# Altium schematic sheet PCIe-M2.SchDoc
size 420 x 297 mm; Organization: Q-Wave Systems Co.,Ltd; Address1: No.1; Address2: Suksawat 33/1; Address3: Ratburana; Address4: Bangkok Thailand
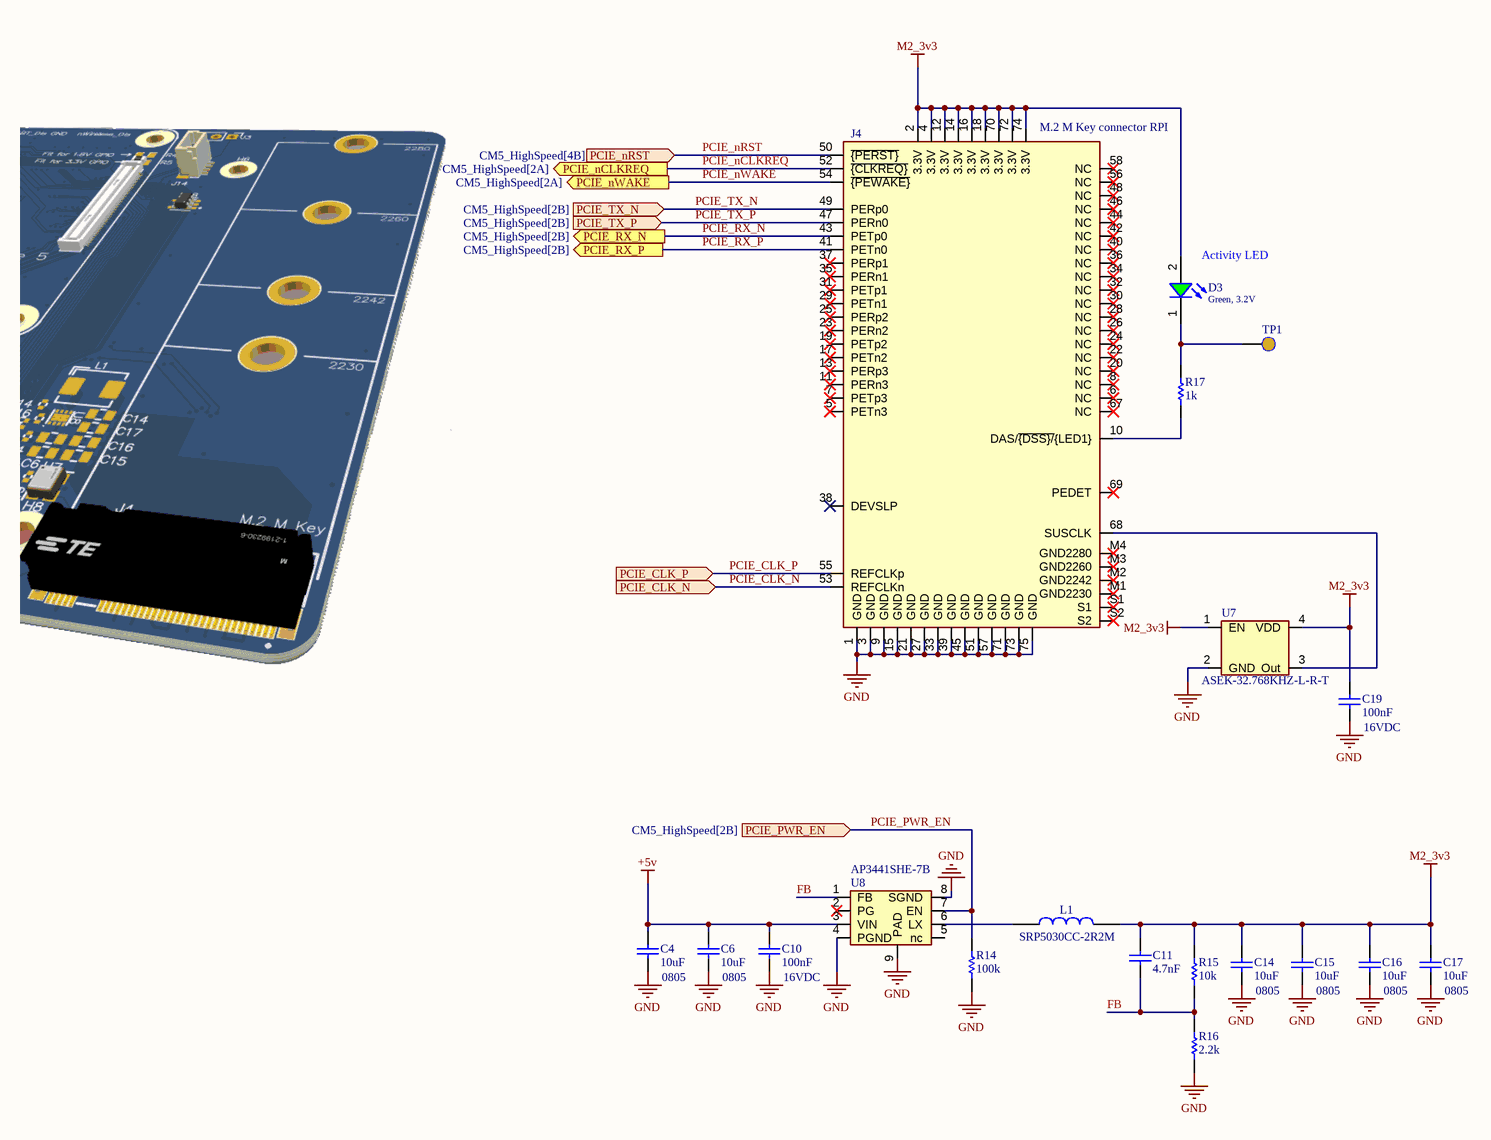
[diagram p0: PCIe-M2.SchDoc]

## Parts
C4  value 10uF  Size: 0805  [WCAP-CSGP_0805_H=1.25mm]  (hidden comment: 10uF, 16V)
C6  value 10uF  Size: 0805  [WCAP-CSGP_0805_H=1.25mm]  (hidden comment: 10uF, 16V)
C10  value 100nF  Rated Voltage: 16VDC  [WCAP-CSGP_0402_H=0.5mm]  (hidden comment: 100nF, 16V)
C11  value 4.7nF  [WCAP-CSGP_0402_H=0.5mm]  (hidden comment: 4.7nF, 16V)
C14  value 10uF  Size: 0805  [WCAP-CSGP_0805_H=1.25mm]  (hidden comment: 10uF, 16V)
C15  value 10uF  Size: 0805  [WCAP-CSGP_0805_H=1.25mm]  (hidden comment: 10uF, 16V)
C16  value 10uF  Size: 0805  [WCAP-CSGP_0805_H=1.25mm]  (hidden comment: 10uF, 16V)
C17  value 10uF  Size: 0805  [WCAP-CSGP_0805_H=1.25mm]  (hidden comment: 10uF, 16V)
C19  value 100nF  Rated Voltage: 16VDC  [WCAP-CSGP_0402_H=0.5mm]  (hidden comment: 100nF, 16V)
D3  Green, 3.2V  [WL-SMCW_0603_H=0.7mm_Green]
J4  M.2 M Key connector RPI  [M.2 M Key connector RPI]
L1  SRP5030CC-2R2M  [SRP5030CC-2R2M]
R14  value 100k  [SMD-0402-RES]  (hidden comment: RES SMD 100K OHM 1% 1/10W 0402)
R15  value 10k  [SMD-0402-RES]  (hidden comment: RES SMD 10K OHM 1% 1/10W 0402)
R16  value 2.2k  [SMD-0402-RES]  (hidden comment: RES SMD 2.2K OHM 1% 1/10W 0402)
R17  value 1k  [SMD-0402-RES]  (hidden comment: RES SMD 1K OHM 1% 1/10W 0402)
TP1  TEST_POINT 1  [TEST_POINT 1]  (value not drawn)  (no BOM)
U7  ASEK-32.768KHZ-L-R-T  [ASEK-32.768KHZ-L-R-T]
U8  AP3441SHE-7B  [AP3441SHE-7B]

## Ports
PCIE_CLK_N (in, see CM5_HighSpeed[2B]), PCIE_CLK_P (in, see CM5_HighSpeed[2B]), PCIE_nCLKREQ (out, see CM5_HighSpeed[2A]), PCIE_nRST (in, see CM5_HighSpeed[4B]), PCIE_nWAKE (out, see CM5_HighSpeed[2A]), PCIE_PWR_EN (in, see CM5_HighSpeed[2B]), PCIE_RX_N (out, see CM5_HighSpeed[2B]), PCIE_RX_P (out, see CM5_HighSpeed[2B]), PCIE_TX_N (in, see CM5_HighSpeed[2B]), PCIE_TX_P (in, see CM5_HighSpeed[2B])

## Nets
+5v: C4.2 C6.2 C10.2 U8.3(VIN)
GND: C4.1 C6.1 C10.1 C14.1 C15.1 C16.1 C17.1 C19.1 J4.1(GND) J4.3(GND) J4.9(GND) J4.15(GND) J4.21(GND) J4.27(GND) J4.33(GND) J4.39(GND) J4.45(GND) J4.51(GND) J4.57(GND) J4.71(GND) J4.73(GND) J4.75(GND) R14.1 R16.1 U7.2(GND) U8.4(PGND) U8.8(SGND) U8.9(PAD)
M2_3v3: C11.2 C14.2 C15.2 C16.2 C17.2 C19.2 D3.2(A) J4.2(3.3V) J4.4(3.3V) J4.12(3.3V) J4.14(3.3V) J4.16(3.3V) J4.18(3.3V) J4.70(3.3V) J4.72(3.3V) J4.74(3.3V) L1.2 R15.2 U7.1(EN) U7.4(VDD)
FB: C11.1 R15.1 R16.2 U8.1(FB)
PCIE_CLK_N: J4.53(REFCLKn) ; port PCIE_CLK_N
PCIE_CLK_P: J4.55(REFCLKp) ; port PCIE_CLK_P
PCIE_nCLKREQ: J4.52(~{{CLKREQ}}) ; port PCIE_nCLKREQ
PCIE_nRST: J4.50(~{{PERST}}) ; port PCIE_nRST
PCIE_nWAKE: J4.54(~{{PEWAKE}}) ; port PCIE_nWAKE
PCIE_PWR_EN: R14.2 U8.7(EN) ; port PCIE_PWR_EN
PCIE_RX_N: J4.43(PETp0) ; port PCIE_RX_N
PCIE_RX_P: J4.41(PETn0) ; port PCIE_RX_P
PCIE_TX_N: J4.49(PERp0) ; port PCIE_TX_N
PCIE_TX_P: J4.47(PERn0) ; port PCIE_TX_P
NetD3_1: D3.1(K) R17.2 TP1.1
NetJ4_10: J4.10(DAS/~{{DSS}/}{LED1}) R17.1
NetJ4_68: J4.68(SUSCLK) U7.3(Out)
NetL1_1: L1.1 U8.6(LX)

Not connected (* = marked no-connect by the designer): J4 5(PETn3)* 6(NC)* 7(PETp3)* 8(NC)* 11(PERn3)* 13(PERp3)* 17(PETn2)* 19(PETp2)* 20(NC)* 22(NC)* 23(PERn2)* 24(NC)* 25(PERp2)* 26(NC)* 28(NC)* 29(PETn1)* 30(NC)* 31(PETp1)* 32(NC)* 34(NC)* 35(PERn1)* 36(NC)* 37(PERp1)* 38(DEVSLP)* 40(NC)* 42(NC)* 44(NC)* 46(NC)* 48(NC)* 56(NC)* 58(NC)* 67(NC)* 69(PEDET)* M1(GND2230)* M2(GND2242)* M3(GND2260)* M4(GND2280)* S1* S2*; U8 2(PG)* 5(nc)

## Notes on the sheet
- (near D3) Activity LED
- Status:
- Revision:
- Variant:
- Vesion:
- Title
- Size:
- Date:
- A3
- DrawnBy:
- Number:
- CheckBy:
- Sheet
- of
- File:

## Library data of the parts
C4 C6 C14-C17 = CMP-01449-2: WCAP-CSGP Multilayer Ceramic Chip Capacitor, General Purpose, size 0805, X5R, 10uF, 16V; Manufacturer: Wurth Elektronik; Manufacturer Part Number: 885012107014; Isolation Resistance  min.: 0.01GOhm; Dissipation Factor max.: 10%; Capacitance Tolerance: +/-20%; Technical Reference: X5R0805106M016DFCT10000; Rated Voltage: 16VDC; Packaging: Tape and Reel; ComponentLink2URL: https://www.we-online.com/catalog/datasheet/885012107014.pdf; Height: 1.25mm; Source: WCAP-CSGP_0805.SchLib; Design Item ID: 885012107014; ComponentLink2Description: Datasheet; Pin Count: 2; Capacitance: 10uF; ComponentLink1URL: http://www.we-online.de; Operating Temperature: -55 to +85degC; Published Date: April 2021; Mounting Technology: SMT; Ceramic Type: X5R; ComponentLink1Description: Manufacturer; Component Type: Standard; Q-Factor min.: -
C10 C19 = CMP-01409-2: WCAP-CSGP Multilayer Ceramic Chip Capacitor, General Purpose, size 0402, X5R, 100nF, 16V; Manufacturer Part Number: 885012105016; Manufacturer: Wurth Elektronik; Technical Reference: X5R0402104M016DFCT10000; Isolation Resistance  min.: 5GOhm; Dissipation Factor max.: 5%; Capacitance Tolerance: +/-20%; Published Date: April 2021; Height: 0.5mm; Operating Temperature: -55 to +85degC; Source: WCAP-CSGP_0402.SchLib; Packaging: Tape and Reel; Q-Factor min.: -; Component Type: Standard; Capacitance: 100nF; Ceramic Type: X5R; ComponentLink1Description: Manufacturer; ComponentLink1URL: http://www.we-online.de; ComponentLink2URL: https://www.we-online.com/catalog/datasheet/885012105016.pdf; Pin Count: 2; Size: 0402; Mounting Technology: SMT; Design Item ID: 885012105016; ComponentLink2Description: Datasheet
C11 = CMP-01518-2: WCAP-CSGP Multilayer Ceramic Chip Capacitor, General Purpose, size 0402, X7R, 4.7nF, 16V; Manufacturer: Wurth Elektronik; Manufacturer Part Number: 885012205029; Dissipation Factor max.: 3.5%; Isolation Resistance  min.: 10GOhm; Capacitance Tolerance: +/-10%; Technical Reference: X7R0402472K016DFCT10000; Rated Voltage: 16VDC; Capacitance: 4.7nF; ComponentLink1URL: http://www.we-online.de; ComponentLink2URL: https://www.we-online.com/catalog/datasheet/885012205029.pdf; Height: 0.5mm; Q-Factor min.: -; ComponentLink1Description: Manufacturer; Pin Count: 2; Component Type: Standard; Ceramic Type: X7R; Source: WCAP-CSGP_0402.SchLib; Operating Temperature: -55 to +125degC; Mounting Technology: SMT; ComponentLink2Description: Datasheet; Packaging: Tape and Reel; Size: 0402; Design Item ID: 885012205029; Published Date: April 2021
D3 = CMP-00983-5: WL-SMCW SMT Mono-color Chip LED Waterclear, size 0603, Green, 3.2V, 140deg; Part Number: 150060GS75000; SM P/N: 59100121; Peak Wavelength typ.: 515nm; ES P/N: 0176-1070-9; Luminous Intensity typ.: 430mcd; Chip Technology: InGaN; Dominant Wavelength typ.: 525nm; Pin Count: 2; Forward Voltage typ.: 3.2V; Viewing Angle: 140deg; Packaging: Tape and Reel; Emitting Color: Green; Publisher: Wurth Elektronik; ComponentLink1URL: http://www.we-online.de; Source: WL-SMCW_0603.SchLib; ComponentLink2URL: https://www.we-online.com/catalog/datasheet/150060GS75000.pdf; ComponentLink2Description: Datasheet; Operating Temperature: -40 to +85degC; Design Item ID: 150060GS75000; Size: 0603; Mounting Technology: SMT; Published Date: December 2019; Value: Green, 3.2V; ComponentLink1Description: Manufacturer; Component Type: Standard
J4 = CMP-633-000140-1: M.2 NGFF M-KEY H4.2mm Conn Card Edge SKT 67 POS 0.5mm Solder RA SMD T/R; Gender: Female; Number of Positions: 67; Contact Current Rating: 500mA; SM P/N: 13806721; PCB Mounting Orientation: Right Angle; Termination: Solder; Insulation Material: Thermoplastic; Number of Rows: 2; Housing Color: Black; Min Operating Temperature: -40°C; ELV: Compliant; Height: 0.165inch; Orientation: Right Angle; Pitch: 0.5mm; Contact Plating: Gold,Matte; Mount: Surface Mount; Length: 0.862inch; Width: 8.7mm; RoHS Compliant: Yes; Housing Material: Thermoplastic; Packaging: Tape and Reel; Color: Black; Contact Material: Copper Alloy; Max Operating Temperature: 80°C
L1 = CMP-006-00047-1: Inductor Power Shielded Wirewound 2.2uH 20% 100KHz 15Q-FactorCarbonyl Powder 7A 0.032Ohm DCR 2220 T/R
R14 = CMP-236-000249-2: Manufacturer: Panasonic Electronic Components; Part Number: ERJ-2RKF1003X; Factory Stock: 0; Minimum Quantity: 1; Temperature Coefficient: ±100ppm/°C; Power (Watts): 0.1W, 1/10W; @ qty: 1500; Unit Price (USD): 0.00496; Size / Dimension: 0.039" L x 0.020" W (1.00mm x 0.50mm); Datasheets: http://industrial.panasonic.com/www-cgi/jvcr13pz.cgi?E+PZ+3+AOA0002+ERJ2RKF1003X+7+WW; Composition: Thick Film; Tolerance: ±1%; Packaging: Cut Tape (CT); Features: Automotive AEC-Q200; Digi-Key Part Number: P100KLCT-ND; Failure Rate: -; Package / Case: 0402 (1005 Metric); Supplier Device Package: 0402; Part Status: Active; Height - Seated (Max): 0.016" (0.40mm); Operating Temperature: -55°C ~ 155°C; Quantity Available: 2645965; Number of Terminations: 2; Series: ERJ; Image: //media.digikey.com/Photos/Panasonic%20Photos/ERJ-PA2-Series.jpg
R15 = CMP-236-000248-2: Manufacturer: Panasonic Electronic Components; Part Number: ERJ-2RKF1002X; Temperature Coefficient: ±100ppm/°C; Unit Price (USD): 0.00496; Factory Stock: 0; Minimum Quantity: 1; Power (Watts): 0.1W, 1/10W; @ qty: 1500; Supplier Device Package: 0402; Packaging: Cut Tape (CT); Operating Temperature: -55°C ~ 155°C; Image: //media.digikey.com/Photos/Panasonic%20Photos/ERJ-PA2-Series.jpg; Package / Case: 0402 (1005 Metric); Height - Seated (Max): 0.016" (0.40mm); Size / Dimension: 0.039" L x 0.020" W (1.00mm x 0.50mm); Series: ERJ; Composition: Thick Film; Part Status: Active; Digi-Key Part Number: P10.0KLCT-ND; Quantity Available: 9922786; Features: Automotive AEC-Q200; Failure Rate: -; Tolerance: ±1%; Number of Terminations: 2; Datasheets: http://industrial.panasonic.com/www-cgi/jvcr13pz.cgi?E+PZ+3+AOA0002+ERJ2RKF1002X+7+WW
R16 = CMP-236-000428-2: Part Number: ERJ-2RKF2201X; Manufacturer: Panasonic Electronic Components; Power (Watts): 0.1W, 1/10W; Factory Stock: 0; Temperature Coefficient: ±100ppm/°C; Minimum Quantity: 1; @ qty: 1500; Unit Price (USD): 0.00496; Supplier Device Package: 0402; Height - Seated (Max): 0.016" (0.40mm); Tolerance: ±1%; Composition: Thick Film; Features: Automotive AEC-Q200; Datasheets: http://industrial.panasonic.com/www-cgi/jvcr13pz.cgi?E+PZ+3+AOA0002+ERJ2RKF2201X+7+WW; Size / Dimension: 0.039" L x 0.020" W (1.00mm x 0.50mm); Series: ERJ; Digi-Key Part Number: P2.20KLCT-ND; Image: //media.digikey.com/Photos/Panasonic%20Photos/ERJ-PA2-Series.jpg; Operating Temperature: -55°C ~ 155°C; Part Status: Active; Failure Rate: -; Quantity Available: 301785; Number of Terminations: 2; Packaging: Cut Tape (CT); Package / Case: 0402 (1005 Metric)
R17 = CMP-236-000247-2: Manufacturer: Panasonic Electronic Components; Part Number: ERJ-2RKF1001X; Factory Stock: 0; Unit Price (USD): 0.00496; Temperature Coefficient: ±100ppm/°C; Power (Watts): 0.1W, 1/10W; @ qty: 1500; Minimum Quantity: 1; Series: ERJ; Package / Case: 0402 (1005 Metric); Part Status: Active; Packaging: Cut Tape (CT); Number of Terminations: 2; Height - Seated (Max): 0.016" (0.40mm); Image: //media.digikey.com/Photos/Panasonic%20Photos/ERJ-PA2-Series.jpg; Quantity Available: 1787831; Datasheets: http://industrial.panasonic.com/www-cgi/jvcr13pz.cgi?E+PZ+3+AOA0002+ERJ2RKF1001X+7+WW; Failure Rate: -; Supplier Device Package: 0402; Tolerance: ±1%; Composition: Thick Film; Size / Dimension: 0.039" L x 0.020" W (1.00mm x 0.50mm); Features: Automotive AEC-Q200; Operating Temperature: -55°C ~ 155°C; Digi-Key Part Number: P1.00KLCT-ND
TP1 = CMP-633-000141-1: Test Point SMT PAD; Component Type: Standard (No BOM); Pin Count: 1; Design Item ID: TEST_POINT
U7 = CMP-003-00021-1: Oscillator XO 0.032768MHz ±25ppm 15pF 60% 3.3V 4-Pin SMD T/R
U8 = CMP-000466-1: Dc/dc Conv, Buck, 1Mhz, -40 To 85Deg C Rohs Compliant: Yes; RoHS Compliant: Yes